# EAGLE design waterius-factory-3.4 (EAGLE 9.0.1)
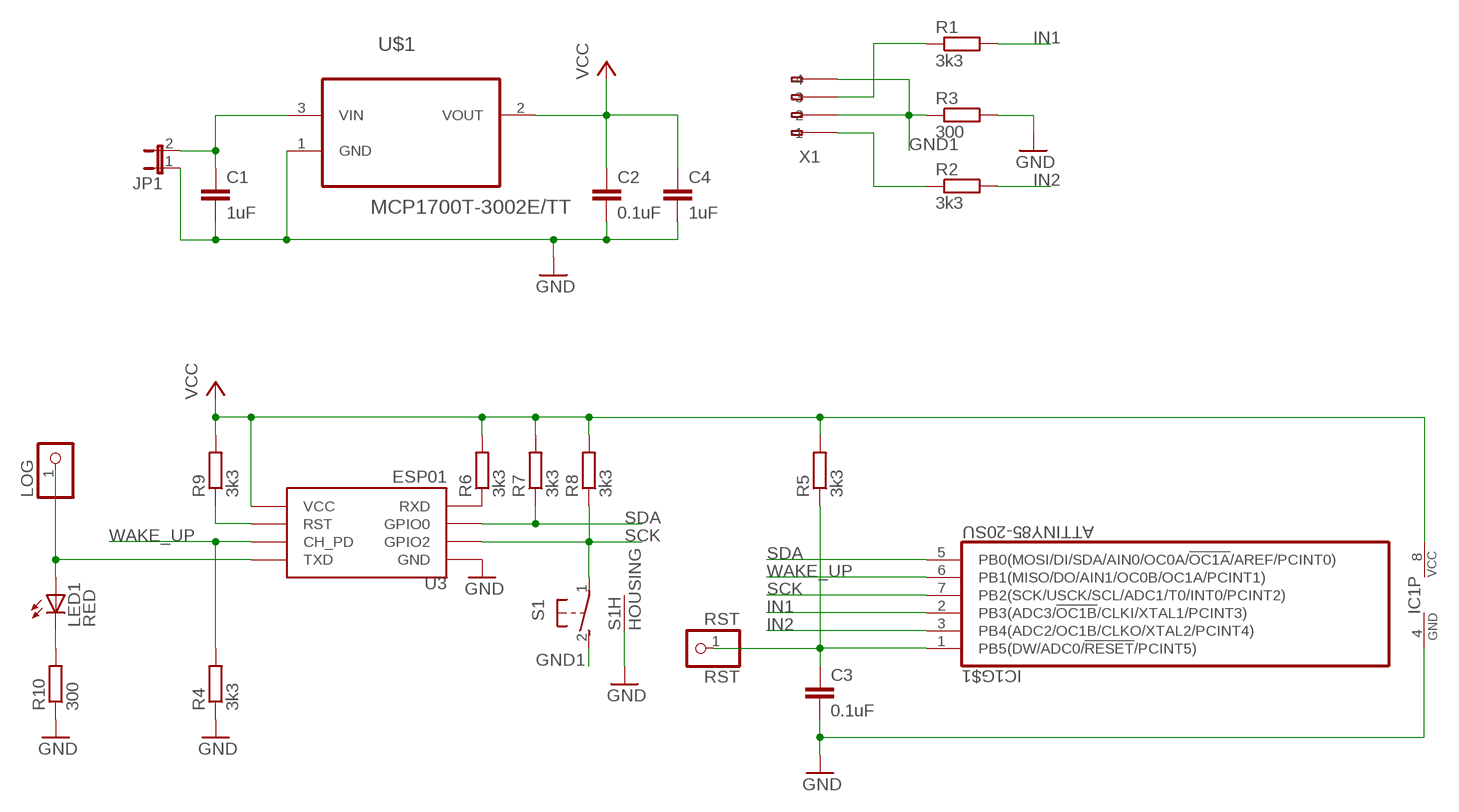
[diagram p0: schematic, sheet 1]

## Parts
C1  1uF  C-EUC0805  [C0805]
C2  0.1uF  C-EUC0805  [C0805]
C3  0.1uF  C-EUC0805  [C0805]
C4  1uF  C-EUC0805  [C0805]
IC1  ATTINY85-20SU  [8S2]
JP1  JP1E  [JP1]
LED1  RED  LED3MM  [LED3MM]
LOG  PINHD-1X1  [1X01]
R1  3k3  R-EU_R0805  [R0805]
R2  3k3  R-EU_R0805  [R0805]
R3  300  R-EU_R0805  [R0805]
R4  3k3  R-EU_R0805  [R0805]
R5  3k3  R-EU_R0805  [R0805]
R6  3k3  R-EU_R0805  [R0805]
R7  3k3  R-EU_R0805  [R0805]
R8  3k3  R-EU_R0805  [R0805]
R9  3k3  R-EU_R0805  [R0805]
R10  300  R-EU_R0805  [R0805]
RST  RST  PINHD-1X1  [1X01]
S1  31-XX  [B3F-31XX]
U3  ESP01  [ESP01]
U$1  MCP1700T-3002E/TT  [SOT95P237X112-3N]
X1  233-104  [233-104]

## Nets
+3V [power]: C2.1 C4.1 IC1.8(P:VCC) R5.2 R6.2 R7.2 R8.2 R9.2 U3.VCC U$1.2(VOUT) ; supply symbol labelled VCC
GND [power]: C1.2 C2.2 C3.2 C4.2 IC1.4(P:GND) JP1.1 R3.2 R4.1 R10.1 S1.3(HOUSING) S1.4(HOUSING) U3.GND U$1.1(GND)
GND1 [power]: R3.1 S1.2(S) X1.A2(-2) X1.A4(-4)
IN1: IC1.2(PB3(ADC3/!OC1B!/CLKI/XTAL1/PCINT3)) R1.2
IN2: IC1.3(PB4(ADC2/OC1B/CLKO/XTAL2/PCINT4)) R2.2
N$2: R6.1 U3.RX(RXD)
N$3: R9.1 U3.RST
N$5: LED1.A LOG.1 U3.TX(TXD)
N$6: LED1.K(C) R10.2
N$7: R1.1 X1.A3(-3)
N$8: R2.1 X1.A1(-1)
PRG_RST: C3.1 IC1.1(PB5(DW/ADC0/!RESET!/PCINT5)) R5.1 RST.1
SCK: IC1.7(PB2(SCK/USCK/SCL/ADC1/T0/INT0/PCINT2)) R8.1 S1.1(P) U3.GPIO2
SDA: IC1.5(PB0(MOSI/DI/SDA/AIN0/OC0A/!OC1A!/AREF/PCINT0)) R7.1 U3.GPIO0
VBAT [power]: C1.1 JP1.2 U$1.3(VIN)
WAKE_UP: IC1.6(PB1(MISO/DO/AIN1/OC0B/OC1A/PCINT1)) R4.2 U3.CH_PD
Unconnected: X1.B1(B-1) X1.B2(B-2) X1.B3(B-3) X1.B4(B-4)

## Library data of the parts
C1-C4 = rcl:C-EU: CAPACITOR, European symbol; SPICEPREFIX: C
IC1 = attiny85:ATTINY*5: 8-bit AVR tiny Microcontroller Status aktiv aktiv aktiv ATtiny25(V) ATtiny45(V) ATtiny85(V) General purpose working registers 32 SRAM 128 B 256 B 512 B Program flash memory 2 kB 4 kB 8 kB EEPROM 128 B 256 B 512 B 8-bit Timer/Counter 1 8-bit Timer/Counter (high speed) 1 USI 1 ADC channels 4 ADC resolution 10 bit AC 1 Watchdog 1 General purpose I/O 6 External interrupts 6 Operating voltage 1.8 ... 5.5 V for ATtiny#5V 2.7 ... 5.5 V for ATtiny#5 Speed grade 0 ... 4 MHz @ 1.8 ... 5.5 V for ATtiny#5V 0 ... 10 MHz @ 2.7 ... 5.5 V for ATtiny#5V 0 ... 10 MHz @ 2.7 ... 5.5 V for ATtiny#5 0 ... 20 MHz @ 4.5 ... 5.5V for ATtiny#5 Clock options calibrated internal 8/6.4 MHz oscillator external crystal oscillator / ceramic resonator external 32.768 kHz low-frequency crystal oscillator internal 128 kHz oscillator high frequency PLL clock external clock input
JP1 = jumper:JP1E: JUMPER
LED1 = led:LED: LED OSRAM: - CHIPLED LG R971, LG N971, LY N971, LG Q971, LY Q971, LO R971, LY R971 LH N974, LH R974 LS Q976, LO Q976, LY Q976 LO Q996 - Hyper CHIPLED LW Q18S LB Q993, LB Q99A, LB R99A - SideLED LS A670, LO A670, LY A670, LG A670, LP A670 LB A673, LV A673, LT A673, LW A673 LH A674 LY A675 LS A676, LA A676, LO A676, LY A676, LW A676 LS A679, LY A679, LG A679 - Hyper Micro SIDELED® LS Y876, LA Y876, LO Y876, LY Y876 LT Y87S - SmartLED LW L88C, LW L88S LB L89C, LB L89S, LG L890 LS L89K, LO L89K, LY L89K LS L896, LA L896, LO L896, LY L896 - TOPLED LS T670, LO T670, LY T670, LG T670, LP T670 LSG T670, LSP T670, LSY T670, LOP T670, LYG T670 LG T671, LOG T671, LSG T671 LB T673, LV T673, LT T673, LW T673 LH T674 LS T676, LA T676, LO T676, LY T676, LB T676, LH T676, LSB T676, LW T676 LB T67C, LV T67C, LT T67C, LS T67K, LO T67K, LY T67K, LW E67C LS E67B, LA E67B, LO E67B, LY E67B, LB E67C, LV E67C, LT E67C LW T67C LS T679, LY T679, LG T679 LS T770, LO T770, LY T770, LG T770, LP T770 LB T773, LV T773, LT T773, LW T773 LH T774 LS E675, LA E675, LY E675, LS T675 LS T776, LA T776, LO T776, LY T776, LB T776 LHGB T686 LT T68C, LB T68C - Hyper Mini TOPLED® LB M676 - Mini TOPLED Santana® LG M470 LS M47K, LO M47K, LY M47K Source: http://www.osram.convergy.de LUXEON: - LUMILED® LXK2-PW12-R00, LXK2-PW12-S00, LXK2-PW14-U00, LXK2-PW14-V00 LXK2-PM12-R00, LXK2-PM12-S00, LXK2-PM14-U00 LXK2-PE12-Q00, LXK2-PE12-R00, LXK2-PE12-S00, LXK2-PE14-T00, LXK2-PE14-U00 LXK2-PB12-K00, LXK2-PB12-L00, LXK2-PB12-M00, LXK2-PB14-N00, LXK2-PB14-P00, LXK2-PB14-Q00 LXK2-PR12-L00, LXK2-PR12-M00, LXK2-PR14-Q00, LXK2-PR14-R00 LXK2-PD12-Q00, LXK2-PD12-R00, LXK2-PD12-S00 LXK2-PH12-R00, LXK2-PH12-S00 LXK2-PL12-P00, LXK2-PL12-Q00, LXK2-PL12-R00 Source: www.luxeon.com KINGBRIGHT: KA-3528ASYC Source: www.kingbright.com
LOG RST = pinhead:PINHD-1X1: PIN HEADER
R1-R10 = resistor:R-EU_: RESISTOR, European symbol
S1 = switch-31-XX:31-XX: OMRON SWITCH; MPN: B3F-3100; OC_FARNELL: 959704; OC_NEWARK: 36M3582
U3 = esp8266modules:ESP01: ESP8266 Wifi module 01
U$1 = MCP1700T-3002E_TT:MCP1700T-3002E/TT: Low Quiescent Current LDO; AVAILABILITY: Unavailable; DESCRIPTION: MCP1700 Series 250 mA 3 V Fixed Output LDO Voltage Regulator - SOT-23; MF: Microchip; MP: MCP1700T-3002E/TT; PACKAGE: SOT-23 Microchip; PRICE: None
X1 = con-wago255:233-104: WAGO; MPN: 233-104; OC_FARNELL: unknown; OC_NEWARK: 28K9046

## Net classes
0 default: clearance 0.205 mm
1 power: width 0.508 mm, clearance 0.305 mm

## Board
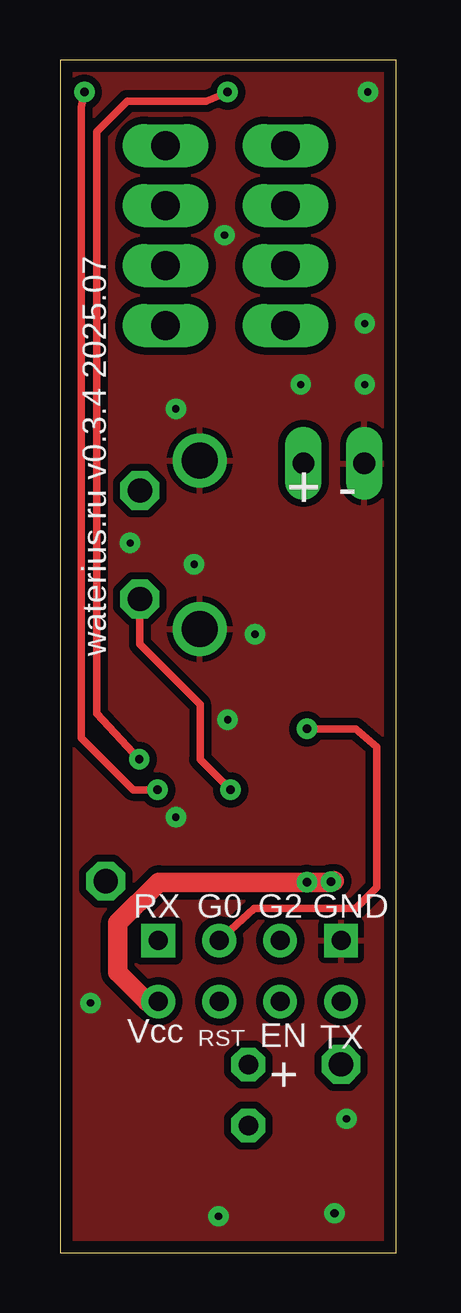
[diagram p1: board, top side]
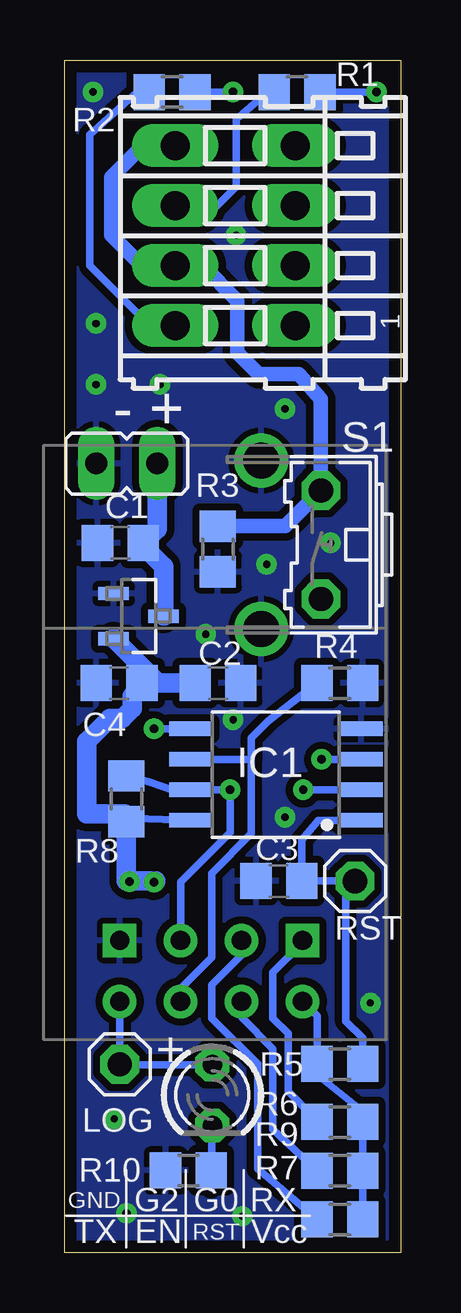
[diagram p2: board, bottom side, seen from below]

Size 14 x 49.72 mm. Coordinates in mm from the lower left corner, seen from the top.
Outline: 0,0 14,0 14,49.72 0,49.72 0,0
Copper layers (1*16): Top 0.035mm / dielectric 1.5mm / Bottom 0.035mm
Design rules "waterius-factory-3.0": minimum track width 0.25mm, minimum drill 0.3mm, track to track 0.205mm, track to pad 0.205mm, pad to pad 0.205mm, via to via 0.205mm, smd to smd 6mil, copper to edge 0.5mm, drill to drill 0.2mm, minimum pad ring 0.3mm, minimum via ring 0.25mm, stop-mask expansion 4mil, vias tented up to drill 0mil, thermal gap 10mil

### Footprints (pad centres in the part's own frame; a part is rotated, then mirrored left to right if it is on the bottom)
C0805 = smd 1.3 x 1.5: 1 -0.95,0; 2 0.95,0
8S2 = smd 0.6 x 1.8: 1 -1.905,-3.55; 2 -0.635,-3.55; 3 0.635,-3.55; 4 1.905,-3.55; 5 1.905,3.55; 6 0.635,3.55; 7 -0.635,3.55; 8 -1.905,3.55
JP1 = drill 0.914 long: 1 0,-1.27; 2 0,1.27
LED3MM = drill 0.813 octagon: A -1.27,0; K 1.27,0
1X01 = drill 1.016 octagon: 1 0,0
R0805 = smd 1.3 x 1.5: 1 -0.95,0; 2 0.95,0
B3F-31XX = drill 1.016 octagon: 1 -2.261,-1.245; 2 2.261,-1.245 | drill 1.499 pad 2.159: 3 -3.505,1.245; 4 3.505,1.245
ESP01 = drill 0.8: CH_PD -1.285,-8.178; GPIO0 1.255,-5.638; GPIO2 -1.285,-5.638; RST 1.255,-8.178; TX -3.825,-8.178; VCC 3.795,-8.178 | drill 0.8 square: GND -3.825,-5.638; RX 3.795,-5.638
SOT95P237X112-3N = smd 0.559 x 1.27: 1 -0.94,-1.041; 2 0.94,-1.041; 3 0,1.041
233-104 = drill 1.2 long: A1 -3.75,2.5; A2 -1.25,2.5; A3 1.25,2.5; A4 3.75,2.5; B1 -3.75,-2.5; B2 -1.25,-2.5; B3 1.25,-2.5; B4 3.75,-2.5

### Placement (x,y rotation side)
C1  11.68,29.59 180 bottom
C2  7.62,23.75 0 bottom
C3  5.08,15.49 180 bottom
C4  11.73,23.74 180 bottom
IC1  5.21,19.94 90 bottom
JP1  11.41,32.91 270 bottom
LED1  7.85,6.58 270 bottom
LOG  11.71,7.86 0 bottom
R1  4.32,48.39 0 bottom
R2  9.53,48.39 0 bottom
R3  7.62,29.34 270 bottom
R4  2.54,23.75 180 bottom
R5  2.54,7.87 180 bottom
R6  2.54,5.46 0 bottom
R7  2.54,1.4 0 bottom
R8  11.43,18.92 270 bottom
R9  2.54,3.43 0 bottom
R10  8.85,3.44 0 bottom
RST  1.91,15.49 0 bottom
S1  4.57,29.51 90 bottom
U3  7.89,18.66 0 bottom
U$1  10.92,26.54 270 bottom
X1  6.9,42.4 90 bottom

### Tracks (layer width: path | path; a pad name or v marks a point on that pad's centre or on a via)
+3V  (via drill 0.35)
  Top 0.813: U3.VCC 3.62,10.48 2.41,11.68 2.41,13.74 4.12,15.45 v10.29,15.45 11.28,15.45 v11.3,15.47 11.43,15.49
  Bottom 0.152: C2.1 C4.1
  Bottom 0.305: R7.2 R9.2 R6.2 1.59,5.91 3.49,7.43 R5.2 3.49,9.88 U3.VCC | IC1.8 11.11,18.1 R8.2
  Bottom 0.813: U$1.2 10.11,23.75 C2.1 | C4.1 11.2,23.2 11.2,22.7 11.61,22.28 12.12,22.28 13.09,21.31 13.09,18.29 11.5,18.29 R8.2 11.43,15.49 10.2,15.49 10.24,15.45 v10.29,15.45
GND  (via drill 0.3 pad 0.85, 0.35 pad 0.85)
  other vias: 11.43,1.65 12.83,48.39 6.99,22.23 8.13,25.78 12.7,38.73 10.03,36.2 6.6,1.52 2.92,29.59 1.27,10.41 12.7,36.2 5.59,28.7 4.83,35.18 6.86,42.42 11.94,5.59 4.83,18.16
  pour Bottom: 0,0 14,0 14,49.72 0,49.73
  pour Top: 0,0 14,0 14,49.72 0,49.72
GND1
  Bottom 0.61: X1.A4 10.74,46.15 12.06,44.83 12.06,42.42 10.8,41.15 X1.A2 8.26,41.15 6.81,39.7 6.81,37.52 5.92,36.63 4.25,36.63 3.33,35.59 S1.2 4.82,30.29 R3.1
IN1  (via drill 0.35)
  Top 0.305: v1.02,48.39 0.89,47.75 0.89,21.46 3.05,19.3 v4.06,19.3
  Bottom 0.305: IC1.2 v4.06,19.3 4.19,19.3 | R1.2 v1.02,48.39
IN2  (via drill 0.35)
  Top 0.305: v6.99,48.39 6.1,48.01 2.79,48.01 1.52,46.74 1.52,22.48 v3.3,20.57
  Bottom 0.305: IC1.3 v3.3,20.57 | R2.2 v6.99,48.39
N$2
  Bottom 0.305: U3.RX 4.09,12.92 5.33,11.68 5.33,9.78 4.7,9.14 4.7,6.73 3.68,5.71 R6.1
N$3
  Bottom 0.305: R9.1 5.33,5.15 5.33,8.51 6.63,9.81 U3.RST
N$5
  Bottom 0.305: U3.TX LOG.1 11.7,7.85 LED1.A
N$6
  Bottom 0.305: LED1.K 7.9,2.72 R10.2
N$7
  Bottom 0.25: R1.1 5.46,48.39
  Bottom 0.305: X1.A3 7.66,43.65 6.86,44.45 6.86,47.24 5.84,48.13 5.46,48.39
N$8
  Bottom 0.305: X1.A1 10.46,38.65 12.95,41.15 12.95,46.61 10.54,48.77 R2.1
PRG_RST
  Bottom 0.305: 2.29,15.49 C3.1 4.13,17.21 3.43,18.03 IC1.1 | R5.1 1.59,8.96 2.29,9.65 2.29,15.49 | 2.29,15.49 RST.1
SCK  (via drill 0.35)
  Top 0.305: S1.1 3.33,25.38 5.84,22.86 5.84,20.57 v7.11,19.3
  Bottom 0.305: R8.1 10.47,19.62 9.53,19.3 IC1.7 v7.11,19.3 7.11,17.53 9.18,15.46 U3.GPIO2
SDA  (via drill 0.35)
  Top 0.305: U3.GPIO0 8.09,14.35 12.32,14.35 13.21,15.24 13.21,21.08 12.32,21.84 v10.29,21.84
  Bottom 0.305: R7.1 5.97,3.5 5.97,7.87 7.87,9.78 7.87,11.18 6.63,12.41 U3.GPIO0 | v10.29,21.84 IC1.5
VBAT
  Bottom 0.61: 10.79,29.53 C1.1
  Bottom 0.813: U$1.3 9.88,28.62 10.79,29.53 10.14,30.18 JP1.2
WAKE_UP
  Bottom 0.305: U3.CH_PD 9.14,10.51 9.14,11.05 7.87,12.32 7.87,15.82 6.22,17.48 6.22,20.57 | R4.2 5.52,22.16 6.22,21.46 6.22,20.57 | 6.22,20.57 IC1.6

### Text on the board
tNames: waterius.ru v0.3.4 2025.07 | + - | RX | G0 | G2 | GND | Vcc | RST | EN | TX | +
bNames: - + | + | RX | G0 | G2 | GND | RST | Vcc | EN | TX